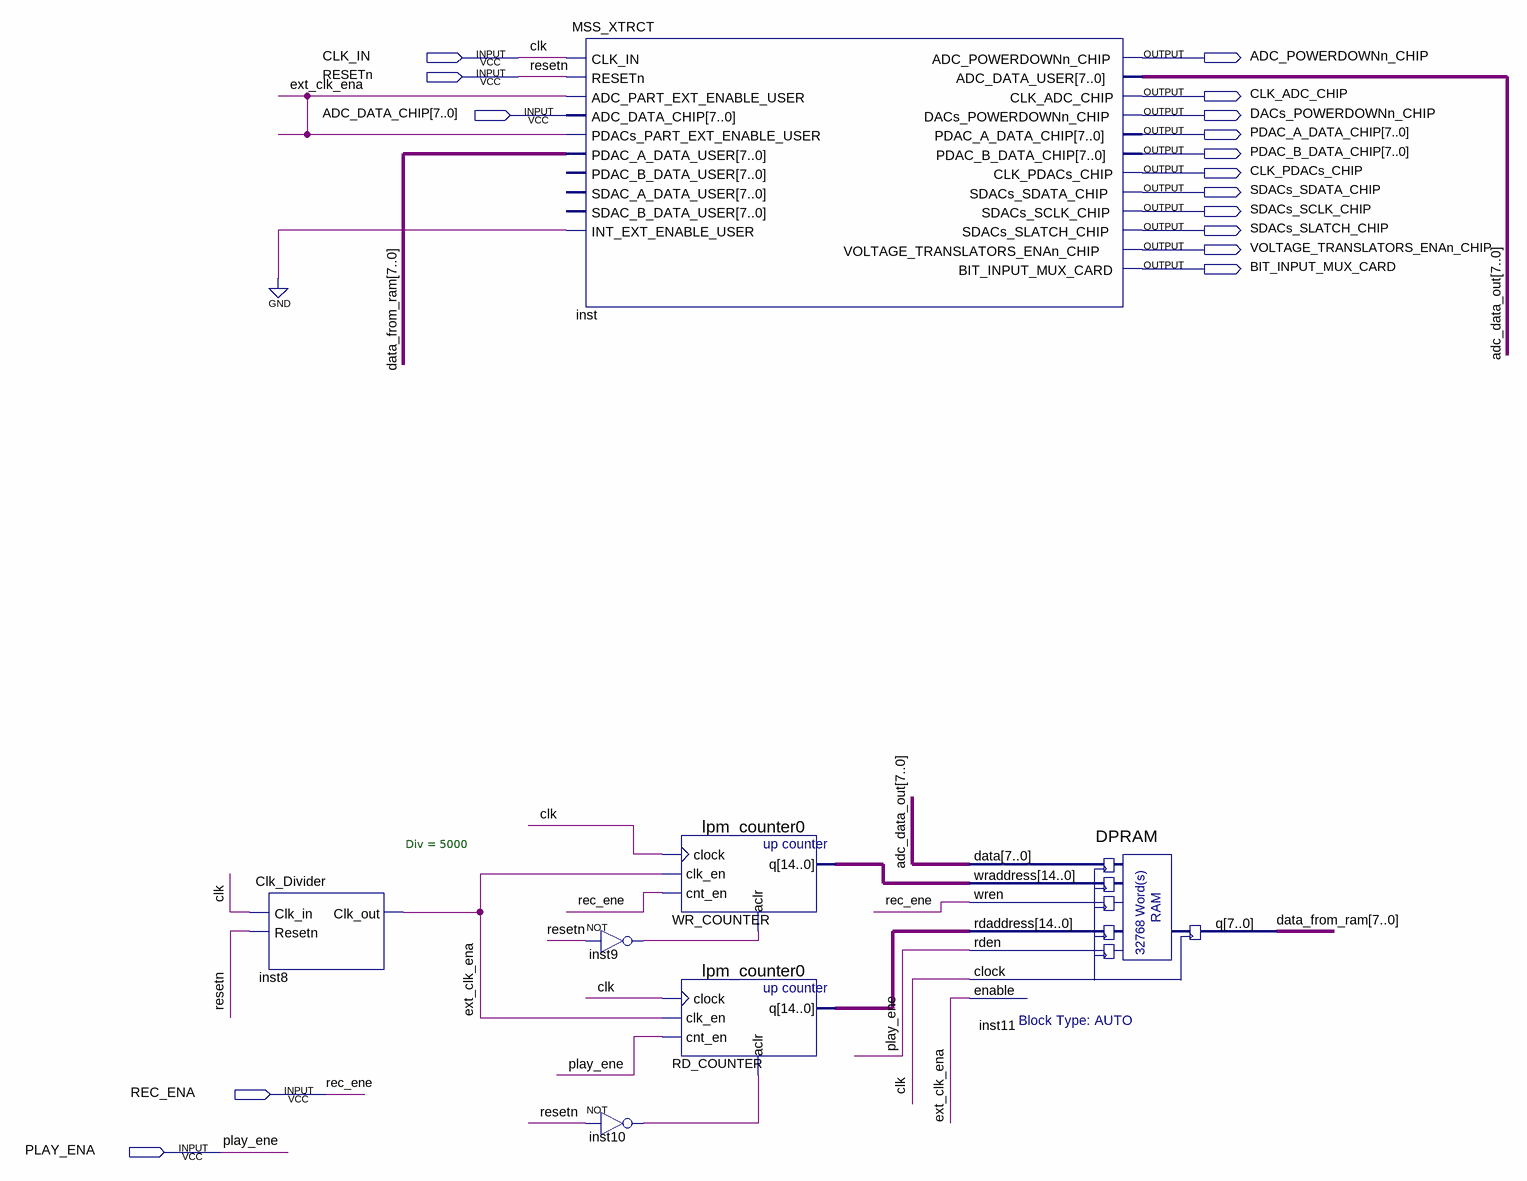
[diagram p0: schematic sheet]
// Quartus schematic MSS_dr.bdf as structural Verilog: 7 symbols, 16 pins
module MSS_dr (
  input  CLK_IN,
  input  RESETn,
  input  [7:0] ADC_DATA_CHIP,
  input  REC_ENA,
  input  PLAY_ENA,
  output ADC_POWERDOWNn_CHIP,
  output CLK_ADC_CHIP,
  output DACs_POWERDOWNn_CHIP,
  output [7:0] PDAC_A_DATA_CHIP,
  output [7:0] PDAC_B_DATA_CHIP,
  output CLK_PDACs_CHIP,
  output SDACs_SDATA_CHIP,
  output SDACs_SCLK_CHIP,
  output SDACs_SLATCH_CHIP,
  output VOLTAGE_TRANSLATORS_ENAn_CHIP,
  output BIT_INPUT_MUX_CARD
);

  wire ext_clk_ena, inst9_out, inst10_out;
  wire [7:0] adc_data_out, data_from_ram;
  wire [14:0] RD_COUNTER_q, WR_COUNTER_q;

  Clk_Divider #(.Div(5000)) inst8 (.Clk_in(CLK_IN), .Resetn(RESETn), .Clk_out(ext_clk_ena));
  MSS_XTRCT inst (
    .CLK_IN(CLK_IN), .RESETn(RESETn), .ADC_PART_EXT_ENABLE_USER(ext_clk_ena), .ADC_DATA_CHIP(ADC_DATA_CHIP),
    .PDACs_PART_EXT_ENABLE_USER(ext_clk_ena), .PDAC_A_DATA_USER(data_from_ram), .INT_EXT_ENABLE_USER(1'b0),
    .ADC_POWERDOWNn_CHIP(ADC_POWERDOWNn_CHIP), .ADC_DATA_USER(adc_data_out), .CLK_ADC_CHIP(CLK_ADC_CHIP),
    .DACs_POWERDOWNn_CHIP(DACs_POWERDOWNn_CHIP), .PDAC_A_DATA_CHIP(PDAC_A_DATA_CHIP),
    .PDAC_B_DATA_CHIP(PDAC_B_DATA_CHIP), .CLK_PDACs_CHIP(CLK_PDACs_CHIP),
    .SDACs_SDATA_CHIP(SDACs_SDATA_CHIP), .SDACs_SCLK_CHIP(SDACs_SCLK_CHIP),
    .SDACs_SLATCH_CHIP(SDACs_SLATCH_CHIP), .VOLTAGE_TRANSLATORS_ENAn_CHIP(VOLTAGE_TRANSLATORS_ENAn_CHIP),
    .BIT_INPUT_MUX_CARD(BIT_INPUT_MUX_CARD));  // open: PDAC_B_DATA_USER, SDAC_A_DATA_USER, SDAC_B_DATA_USER
  not inst9 (inst9_out, RESETn);
  not inst10 (inst10_out, RESETn);
  lpm_counter0 WR_COUNTER (.clock(CLK_IN), .clk_en(ext_clk_ena), .cnt_en(REC_ENA), .aclr(inst9_out), .q(WR_COUNTER_q));
  lpm_counter0 RD_COUNTER (
    .clock(CLK_IN), .clk_en(ext_clk_ena), .cnt_en(PLAY_ENA), .aclr(inst10_out), .q(RD_COUNTER_q));
  DPRAM inst11 (
    .data(adc_data_out), .wraddress(WR_COUNTER_q), .wren(REC_ENA), .rdaddress(RD_COUNTER_q), .rden(PLAY_ENA),
    .clock(CLK_IN), .enable(ext_clk_ena), .q(data_from_ram));

  // Other names for the same wires on the sheet: clk = CLK_IN; play_ene = PLAY_ENA; rec_ene = REC_ENA
endmodule
